# Altium schematic sheet Level_Matching.SchDoc: SIM868 Development Board
size 119 x 149 mm; SheetNumber: 13; SheetTotal: 14
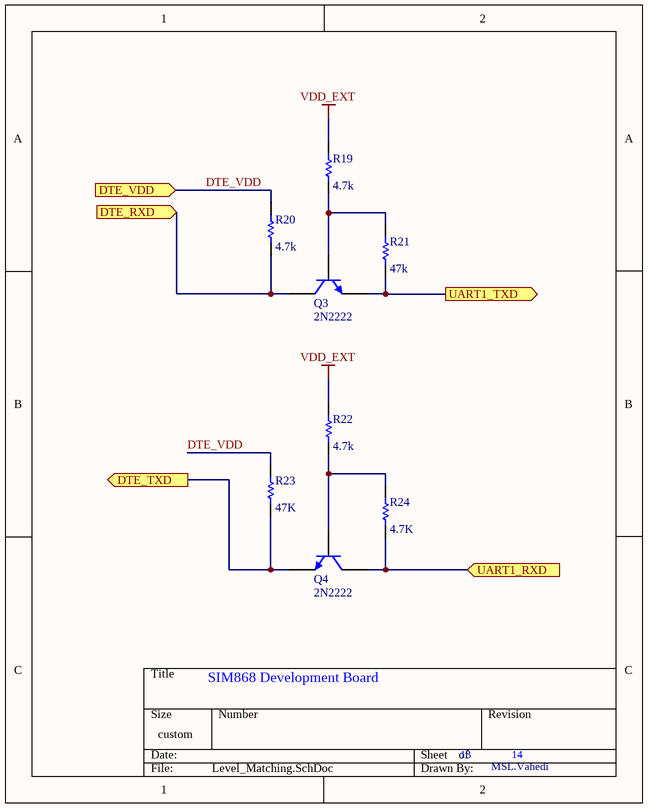
[diagram p0: Level_Matching.SchDoc]

## Parts
Q3  2N2222  [SOT-23]
Q4  2N2222  [SOT-23]
R19  value 4.7k  [RES0805]
R20  value 4.7k  [RES0805]
R21  value 47k  [RES0805]
R22  value 4.7k  [RES0805]
R23  value 47K  [RES0805]
R24  value 4.7K  [RES0805]

## Ports
DTE_RXD (in), DTE_TXD (out), DTE_VDD (in), UART1_RXD (in), UART1_TXD (out)

## Nets
VDD_EXT: R19.1 R22.1
DTE_RXD: Q3.3(C) R20.2 ; port DTE_RXD
DTE_TXD: Q4.1(E) R23.2 ; port DTE_TXD
DTE_VDD: R20.1 R23.1 ; port DTE_VDD
UART1_RXD: Q4.3(C) R24.2 ; port UART1_RXD
UART1_TXD: Q3.1(E) R21.2 ; port UART1_TXD
NetQ3_2: Q3.2(B) R19.2 R21.1
NetQ4_2: Q4.2(B) R22.2 R24.1

## Notes on the sheet
- MSL.Vahedi

## Library data of the parts
Q3 Q4 = 2N3904: NPN General Purpose Amplifier; Published: 8-Jun-2000; LatestRevisionDate: 15-Jan-2003; LatestRevisionNote: PCB Footprint 'BCY-W3/D4.7' replaced; DatasheetVersion: 1997; PackageVersion: Sep-1998; PackageReference: TO-92A; Publisher: Altium Limited; PackageDescription: TO, Flat Index; 3 In-Line, Axial Leads; Body Dia. 4.5mm; Leads 0.51 x 0.48 mm (max); ComponentLink1Description: Manufacturer Link; ComponentLink1URL: http://www.fairchildsemi.com/; ComponentLink2Description: Datasheet; ComponentLink2URL: http://www.fairchildsemi.com/ds/2N%2F2N3904.pdf
R19-R24 = Res1: Resistor; Published: 8-Jun-2000; LatestRevisionDate: 17-Jul-2002; LatestRevisionNote: Re-released for DXP Platform.; PackageReference: AXIAL-0.3; Publisher: Altium Limited; PackageDescription: Axial Device, Thru-Hole; 2 Leads; 0.3 in Pin Spacing